# EAGLE design Fuente_ESIQUIE_2 (EAGLE 7.7.0)
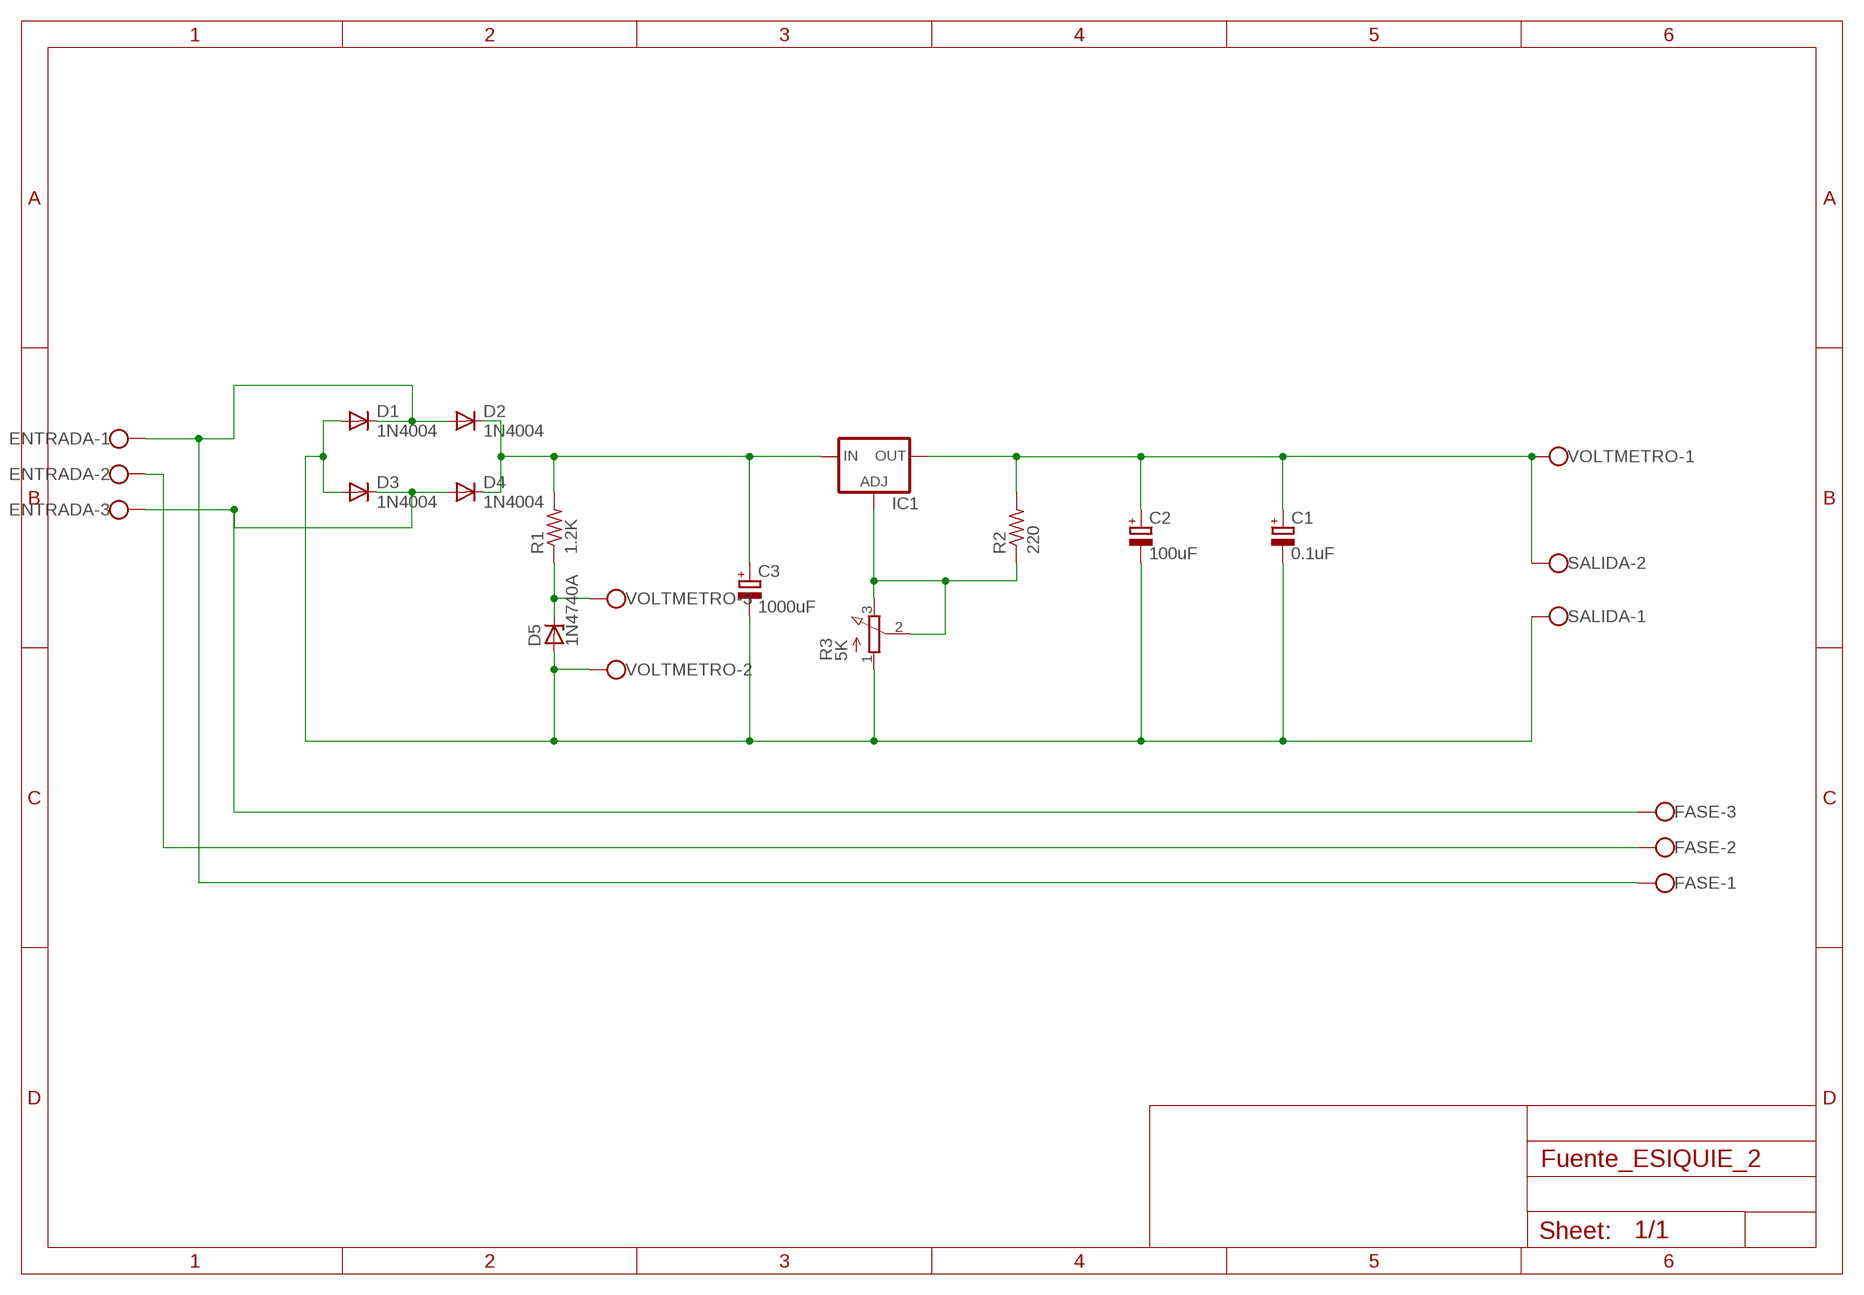
[diagram p0: schematic, sheet 1]

## Parts
C1  0.1uF  CPOL-EUE3.5-8  [E3,5-8]
C2  100uF  CPOL-EUE3.5-8  [E3,5-8]
C3  1000uF  CPOL-EUE7.5-16  [E7,5-16]
D1  1N4004  [DO41-10]
D2  1N4004  [DO41-10]
D3  1N4004  [DO41-10]
D4  1N4004  [DO41-10]
D5  1N4740A  1N4728  [DO41Z10]
ENTRADA  W237-103  [W237-103]
FASE  W237-103  [W237-103]
IC1  LM317TS  [317TS]
R1  1.2K  R-US_0207/12  [0207/12]
R2  220  R-US_0207/12  [0207/12]
R3  5K  3RP/1610N  [3RP/1610N]
SALIDA  W237-102  [W237-102]
VOLTMETRO  W237-103  [W237-103]

## Nets
N$1: D1.C D2.A ENTRADA.1 FASE.1
N$2: D3.C D4.A ENTRADA.3 FASE.3
N$3: C1.- C2.- C3.- D1.A D3.A D5.A R3.1(A) SALIDA.1 VOLTMETRO.2
N$4: C3.+ D2.C D4.C IC1.3(IN) R1.2
N$5: IC1.1(ADJ) R2.1 R3.2(S) R3.3(E)
N$9: C1.+ C2.+ IC1.2(OUT) R2.2 SALIDA.2 VOLTMETRO.1
N$10: D5.C R1.1 VOLTMETRO.3
N$11: ENTRADA.2 FASE.2

## Library data of the parts
C1-C3 = rcl:CPOL-EU: POLARIZED CAPACITOR, European symbol
D1-D4 = diode:1N4004: DIODE general purpose rectifier, 1 A
D5 = diode:1N4728: Z DIODE 3.3 V, 1W, 5 percent
ENTRADA FASE VOLTMETRO = con-wago-500:W237-103: WAGO SCREW CLAMP; MPN: 237-103; OC_FARNELL: unknown; OC_NEWARK: 18M7116
IC1 = v-reg:LM317TS: VOLTAGE REGULATOR
R1 R2 = rcl:R-US_: RESISTOR, American symbol
R3 = pot:3RP/1610N: 16mm Potentiometer one level Source: http://www.alphapotentiometers.net/html/16mm_pot_2.html
SALIDA = con-wago-500:W237-102: WAGO SCREW CLAMP; MPN: 237-102; OC_FARNELL: unknown; OC_NEWARK: 70K9898

## Board
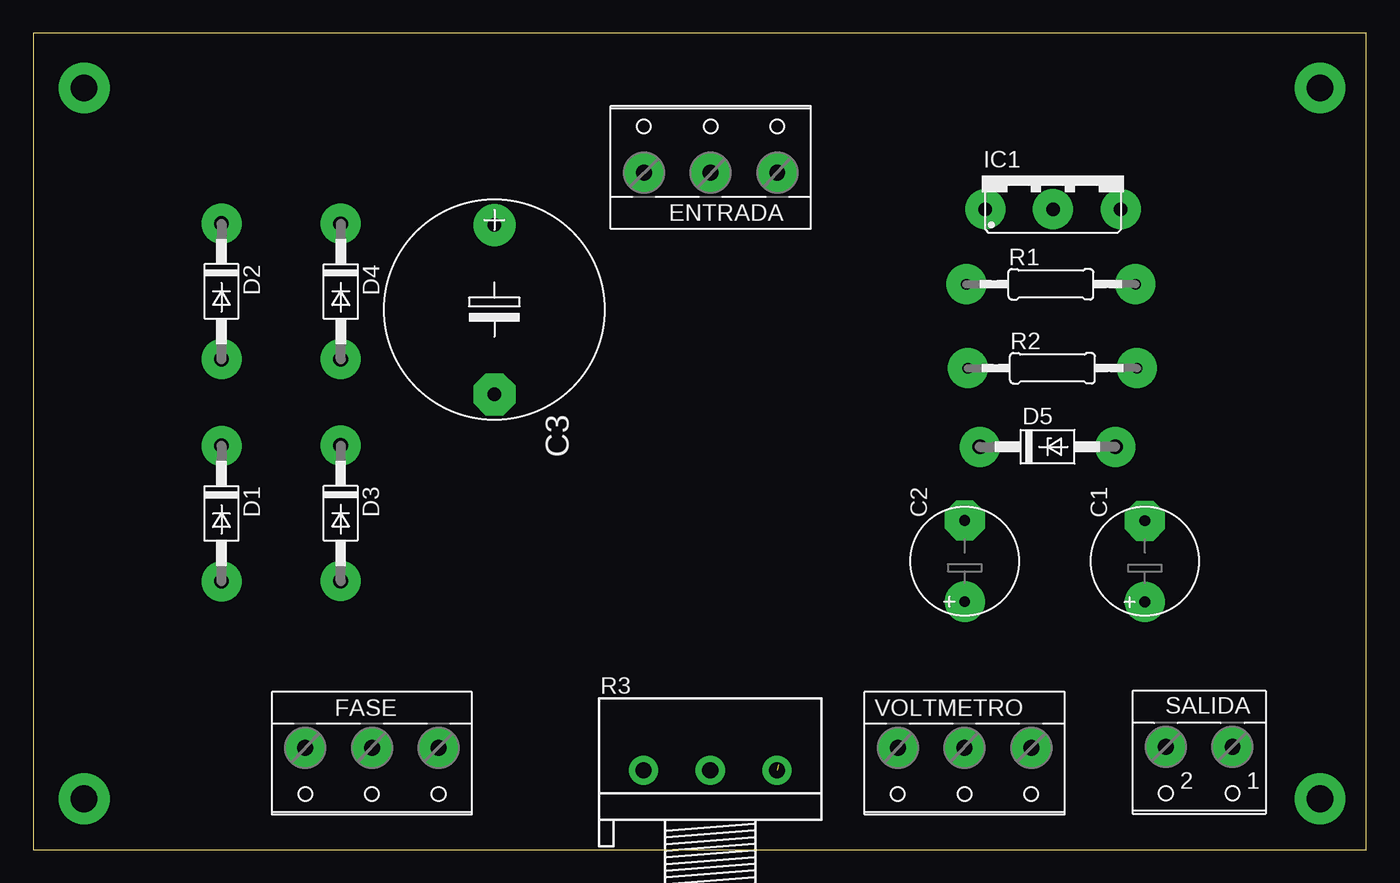
[diagram p1: board, top side]
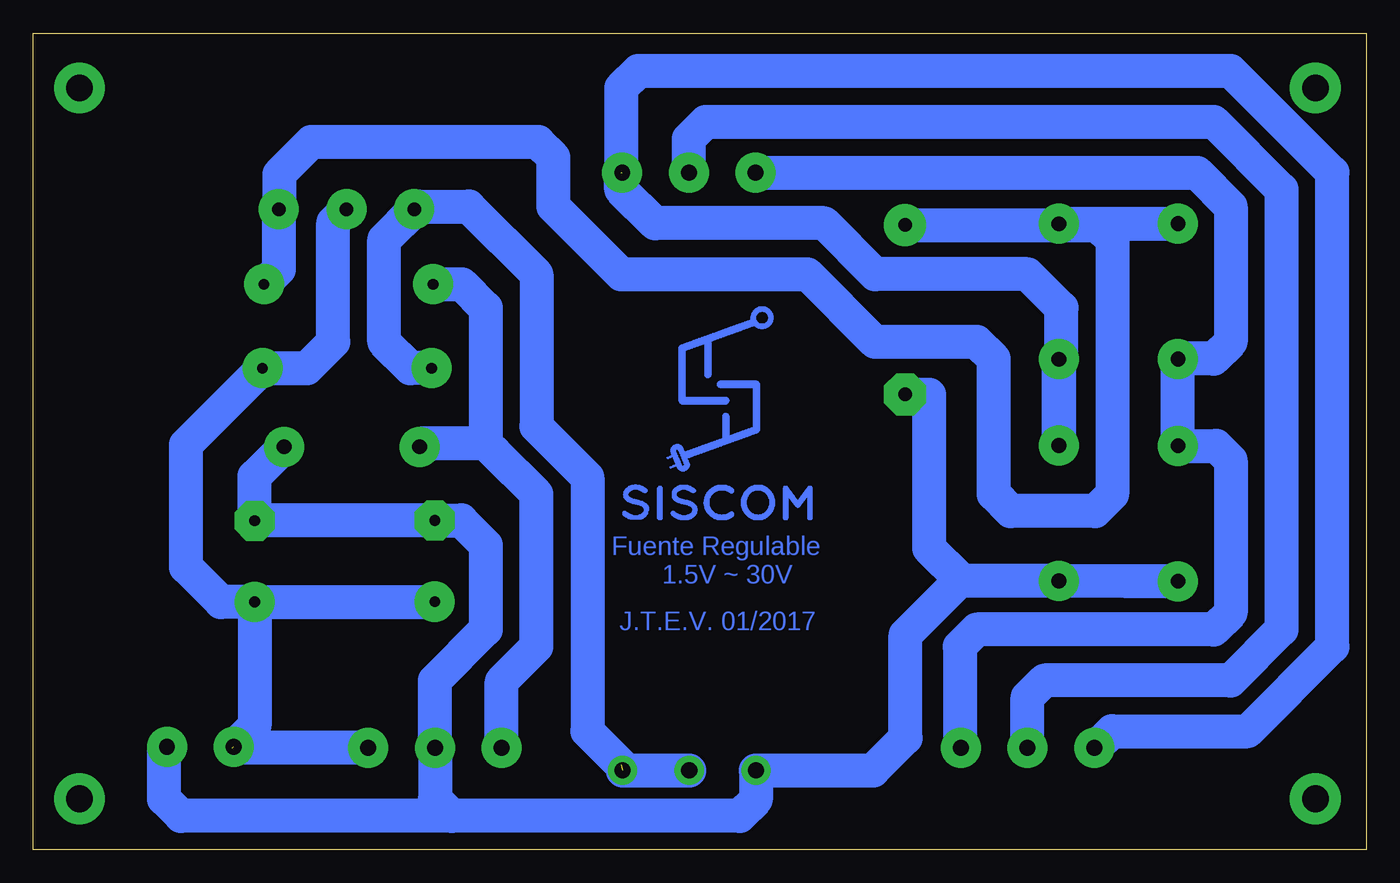
[diagram p2: board, bottom side, seen from below]

Size 99.97 x 61.24 mm. Coordinates in mm from the lower left corner, seen from the top.
Outline: 0,0 99.97,0 99.97,61.24 0,61.24 0,0
Copper layers (1*16): Top 0.035mm / dielectric 1.5mm / Bottom 0.035mm
Design rules "default": minimum track width 10mil, minimum drill 24mil, track to track 8mil, track to pad 8mil, pad to pad 8mil, via to via 8mil, smd to smd 8mil, copper to edge 40mil, drill to drill 8mil, minimum pad ring 10mil, minimum via ring 8mil, stop-mask expansion 4mil, vias tented up to drill 0mil, thermal gap 10mil

### Footprints (pad centres in the part's own frame; a part is rotated, then mirrored left to right if it is on the bottom)
E3,5-8 = drill 0.813 pad 3: + -3.048,0 | drill 0.813 pad 3 octagon: - 3.048,0
E7,5-16 = drill 1.016 pad 3.15: + -6.35,0 | drill 1.016 pad 3.15 octagon: - 6.35,0
DO41-10 = drill 1.118 pad 3: A 5.08,0; C -5.08,0
DO41Z10 = drill 1.118 pad 3: A 5.08,0; C -5.08,0
W237-103 = drill 1.194 pad 3: 1 -5,-1.29; 2 0,-1.29; 3 5,-1.29
317TS = drill 1.016 pad 3: 1 -5.08,-2.54; 2 0,-2.54; 3 5.08,-2.54
0207/12 = drill 0.813 pad 3: 1 -6.35,0; 2 6.35,0
3RP/1610N = drill 1.2 pad 2.184: 1 -5,0; 2 0,0; 3 5,0
W237-102 = drill 1.194 pad 3: 1 -2.5,-1.27; 2 2.5,-1.27

### Placement (x,y rotation side)
C1  83.38,21.63 90 top
C2  69.86,21.65 90 top
C3  34.58,40.51 270 top
D1  14.11,25.22 270 top
D2  14.11,41.88 270 top
D3  23.05,25.23 270 top
D4  23.06,41.87 270 top
D5  76.07,30.23 0 top
ENTRADA  50.8,52.07 0 top
FASE  25.4,6.35 180 top
IC1  76.48,50.58 0 top
R1  76.33,42.42 0 top
R2  76.44,36.12 0 top
R3  50.77,5.94 0 top
SALIDA  87.45,6.44 180 top
VOLTMETRO  69.85,6.35 180 top

### Tracks (layer width: path | path; a pad name or v marks a point on that pad's centre or on a via)
N$1
  Bottom 2.54: ENTRADA.1 12.68,50.78 10.16,48.26 10.16,38.1 11.43,36.83 14.08,36.83 D2.A D1.C 11.25,30.3 10.16,29.21 10.16,17.78 11.43,16.51 29.21,16.51 30.48,15.24 30.48,7.72 FASE.1
N$2  (1 unrouted)
  Bottom 2.54: D4.A 23.06,31.6 D3.C 23.05,36.64 22.86,36.83 22.86,40.64 25.4,43.18 36.83,43.18 40.64,46.99 53.34,46.99 55.88,49.53 55.88,50.8 | ENTRADA.3 55.88,50.86 55.88,57.15 54.61,58.42 10.16,58.42 2.54,50.8 2.54,15.24 8.89,8.89 19.05,8.89 20.3,7.64 FASE.3
N$3
  Bottom 2.54: D1.A 17.96,20.14 D3.A 30.32,20.16 30.42,20.26 | 68.58,2.54 46.99,2.54 45.77,3.75 R3.1 36.98,5.94 34.54,8.38 34.54,16.13 30.42,20.26 | 68.58,2.54 88.9,2.54 90.17,3.81 90.17,7.62 90.04,7.62 SALIDA.1 | 68.58,2.54 69.85,3.81 VOLTMETRO.2 69.85,12.7 66.04,16.51 66.04,22.86 67.88,24.7 C2.- 83.35,24.7 C1.- 83.38,28 D5.A | 30.42,20.26 32.77,22.61 32.77,34.12 C3.-
N$4
  Bottom 2.54: D2.C 14.12,46.95 D4.C 23.15,46.86 C3.+ 20.19,46.86 19.05,45.72 19.05,26.67 20.32,25.4 26.67,25.4 27.94,26.67 27.94,36.83 29.21,38.1 36.83,38.1 41.91,43.18 55.88,43.18 60.96,48.26 60.96,51.94 62.1,53.09 79.12,53.09 81.53,50.67 81.53,48.07 IC1.3 81.56,43.54 R1.2
N$5  (1 unrouted)
  Bottom 2.54: R3.3 R3.2 | 73.66,45.72 73.66,45.78 IC1.1 | R2.1 71.68,36.12 73.66,38.1 73.66,45.72 | 73.66,45.72 71.12,48.26 67.31,48.26 62.23,43.18 62.23,31.75 58.42,27.94 58.42,8.89 55.88,6.35
N$9  (1 unrouted)
  Bottom 2.54: VOLTMETRO.1 85.07,7.64 85.09,7.62 | C1.+ 83.38,9.29 SALIDA.2 | C1.+ 69.89,18.58 C2.+ | C1.+ 85.89,18.58 88.52,21.21 88.52,30.39 R2.2 79.45,36.12 77.47,38.1 77.47,47.05 IC1.2
N$10
  Bottom 2.54: VOLTMETRO.3 64.85,12.62 62.23,15.24 62.23,26.67 65.41,29.84 66.04,30.48 | 66.04,30.48 70.74,30.48 D5.C | R1.1 67.82,42.42 66.04,40.64 66.04,30.48
N$11
  Bottom 2.54: ENTRADA.2 50.8,53.34 49.53,54.61 11.43,54.61 6.35,49.53 6.35,16.51 10.16,12.7 24.13,12.7 25.4,11.43 FASE.2
S$1  (via drill 2 pad 3.81)
  other vias: 3.81,57.15
S$2  (via drill 2 pad 3.81)
  other vias: 96.52,57.15
S$3  (via drill 2 pad 3.81)
  other vias: 96.52,3.81
S$4  (via drill 2 pad 3.81)
  other vias: 3.81,3.81
(copper drawn outside any net)
  shapes: Bottom area x1750

### Text on the board
Bottom: Fuente Regulable / 1.5V ~ 30V | J.T.E.V. 01/2017
tValues: Transformador | Fuente Regulable / 1.5V ~ 30V | J.T.E.V. 01/2017 | Fase ~ | Voltaje Regulado / + - | Rojo | Negro | Blanco | Rojo | (Opcional) | Negro
200bmp: C:/Users/HP TSSI/Downloads/SISCOM_MIRROW.bmp